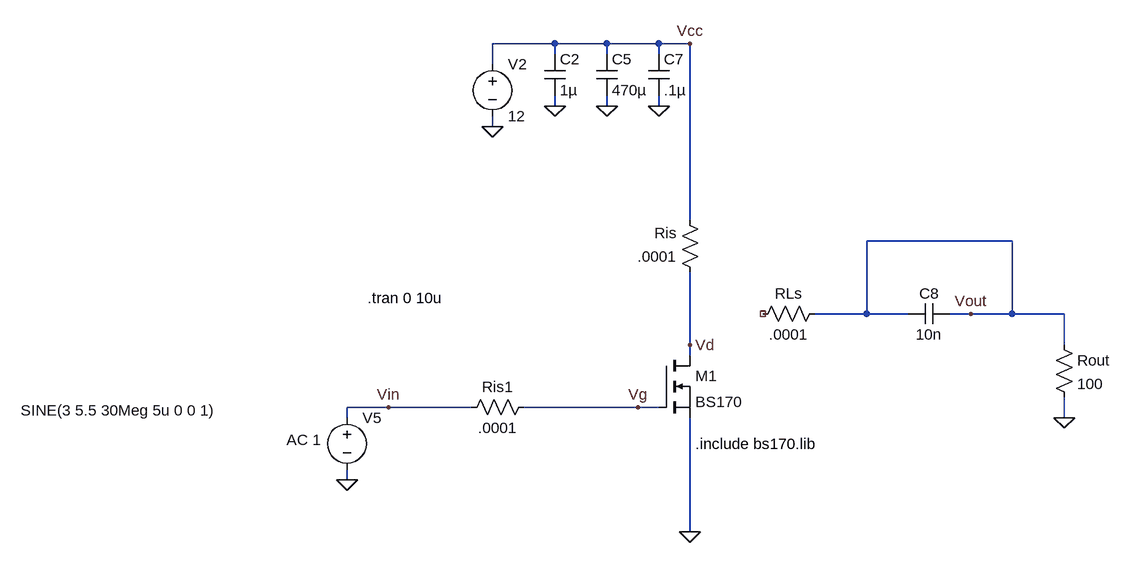
[diagram p0: schematic Mosfet Testing.asc]
Mosfet Testing.asc, the LTspice schematic file:
Version 4
SHEET 1 3060 1616
WIRE 1136 -464 1040 -464
WIRE 1216 -464 1136 -464
WIRE 1296 -464 1216 -464
WIRE 1344 -464 1296 -464
WIRE 1136 -448 1136 -464
WIRE 1216 -448 1216 -464
WIRE 1296 -448 1296 -464
WIRE 1040 -432 1040 -464
WIRE 1136 -368 1136 -384
WIRE 1216 -368 1216 -384
WIRE 1296 -368 1296 -384
WIRE 1040 -336 1040 -352
WIRE 1344 -192 1344 -464
WIRE 1840 -160 1616 -160
WIRE 1616 -48 1616 -160
WIRE 1616 -48 1536 -48
WIRE 1680 -48 1616 -48
WIRE 1776 -48 1744 -48
WIRE 1840 -48 1840 -160
WIRE 1840 -48 1776 -48
WIRE 1920 -48 1840 -48
WIRE 1344 0 1344 -112
WIRE 1920 0 1920 -48
WIRE 1344 16 1344 0
WIRE 880 96 816 96
WIRE 1008 96 880 96
WIRE 1264 96 1088 96
WIRE 1296 96 1264 96
WIRE 816 112 816 96
WIRE 1920 112 1920 80
WIRE 816 208 816 192
WIRE 1344 288 1344 112
FLAG 1040 -336 0
FLAG 1344 288 0
FLAG 1216 -368 0
FLAG 1296 -368 0
FLAG 1136 -368 0
FLAG 1920 112 0
FLAG 1776 -48 Vout
FLAG 1264 96 Vg
FLAG 1344 0 Vd
FLAG 816 208 0
FLAG 880 96 Vin
FLAG 1344 -464 Vcc
SYMBOL voltage 1040 -448 R0
WINDOW 123 0 0 Left 2
WINDOW 39 0 0 Left 2
SYMATTR InstName V2
SYMATTR Value 12
SYMBOL cap 1200 -448 R0
SYMATTR InstName C5
SYMATTR Value 470µ
SYMBOL cap 1280 -448 R0
SYMATTR InstName C7
SYMATTR Value .1µ
SYMBOL cap 1680 -32 R270
WINDOW 0 32 32 VTop 2
WINDOW 3 0 32 VBottom 2
SYMATTR InstName C8
SYMATTR Value 10n
SYMBOL cap 1120 -448 R0
SYMATTR InstName C2
SYMATTR Value 1µ
SYMBOL res 1904 -16 R0
SYMATTR InstName Rout
SYMATTR Value 100
SYMBOL voltage 816 96 R0
WINDOW 123 -93 50 Left 2
WINDOW 39 -141 88 Left 2
WINDOW 3 -502 5 Left 2
SYMATTR Value2 AC 1
SYMATTR Value SINE(3 5.5 30Meg 5u 0 0 1)
SYMATTR InstName V5
SYMBOL nmos 1296 16 R0
SYMATTR InstName M1
SYMATTR Value BS170
SYMBOL res 1552 -64 R90
WINDOW 0 0 56 VBottom 2
WINDOW 3 32 56 VTop 2
SYMATTR InstName RLs
SYMATTR Value .0001
SYMBOL res 1360 -96 R180
WINDOW 0 36 76 Left 2
WINDOW 3 36 40 Left 2
SYMATTR InstName Ris
SYMATTR Value .0001
SYMBOL res 992 112 R270
WINDOW 0 32 56 VTop 2
WINDOW 3 0 56 VBottom 2
SYMATTR InstName Ris1
SYMATTR Value .0001
TEXT 848 -72 Left 2 !.tran 0 10u
TEXT 1352 152 Left 2 !.include bs170.lib

The netlist it stands for:
* Mosfet Testing.asc
V2 Vcc 0 12
C5 Vcc 0 470µ
C7 Vcc 0 .1µ
C8 Vout Vout 10n
C2 Vcc 0 1µ
Rout Vout 0 100
V5 Vin 0 SINE(3 5.5 30Meg 5u 0 0 1) AC 1
M1 Vd Vg 0 0 BS170
RLs Vout NC_01 .0001
Ris Vd Vcc .0001
Ris1 Vin Vg .0001
.model NMOS NMOS
.model PMOS PMOS
.lib standard.mos
.tran 0 10u
.include bs170.lib
.backanno
.end